# EAGLE design USB_carrier (EAGLE 5.11)
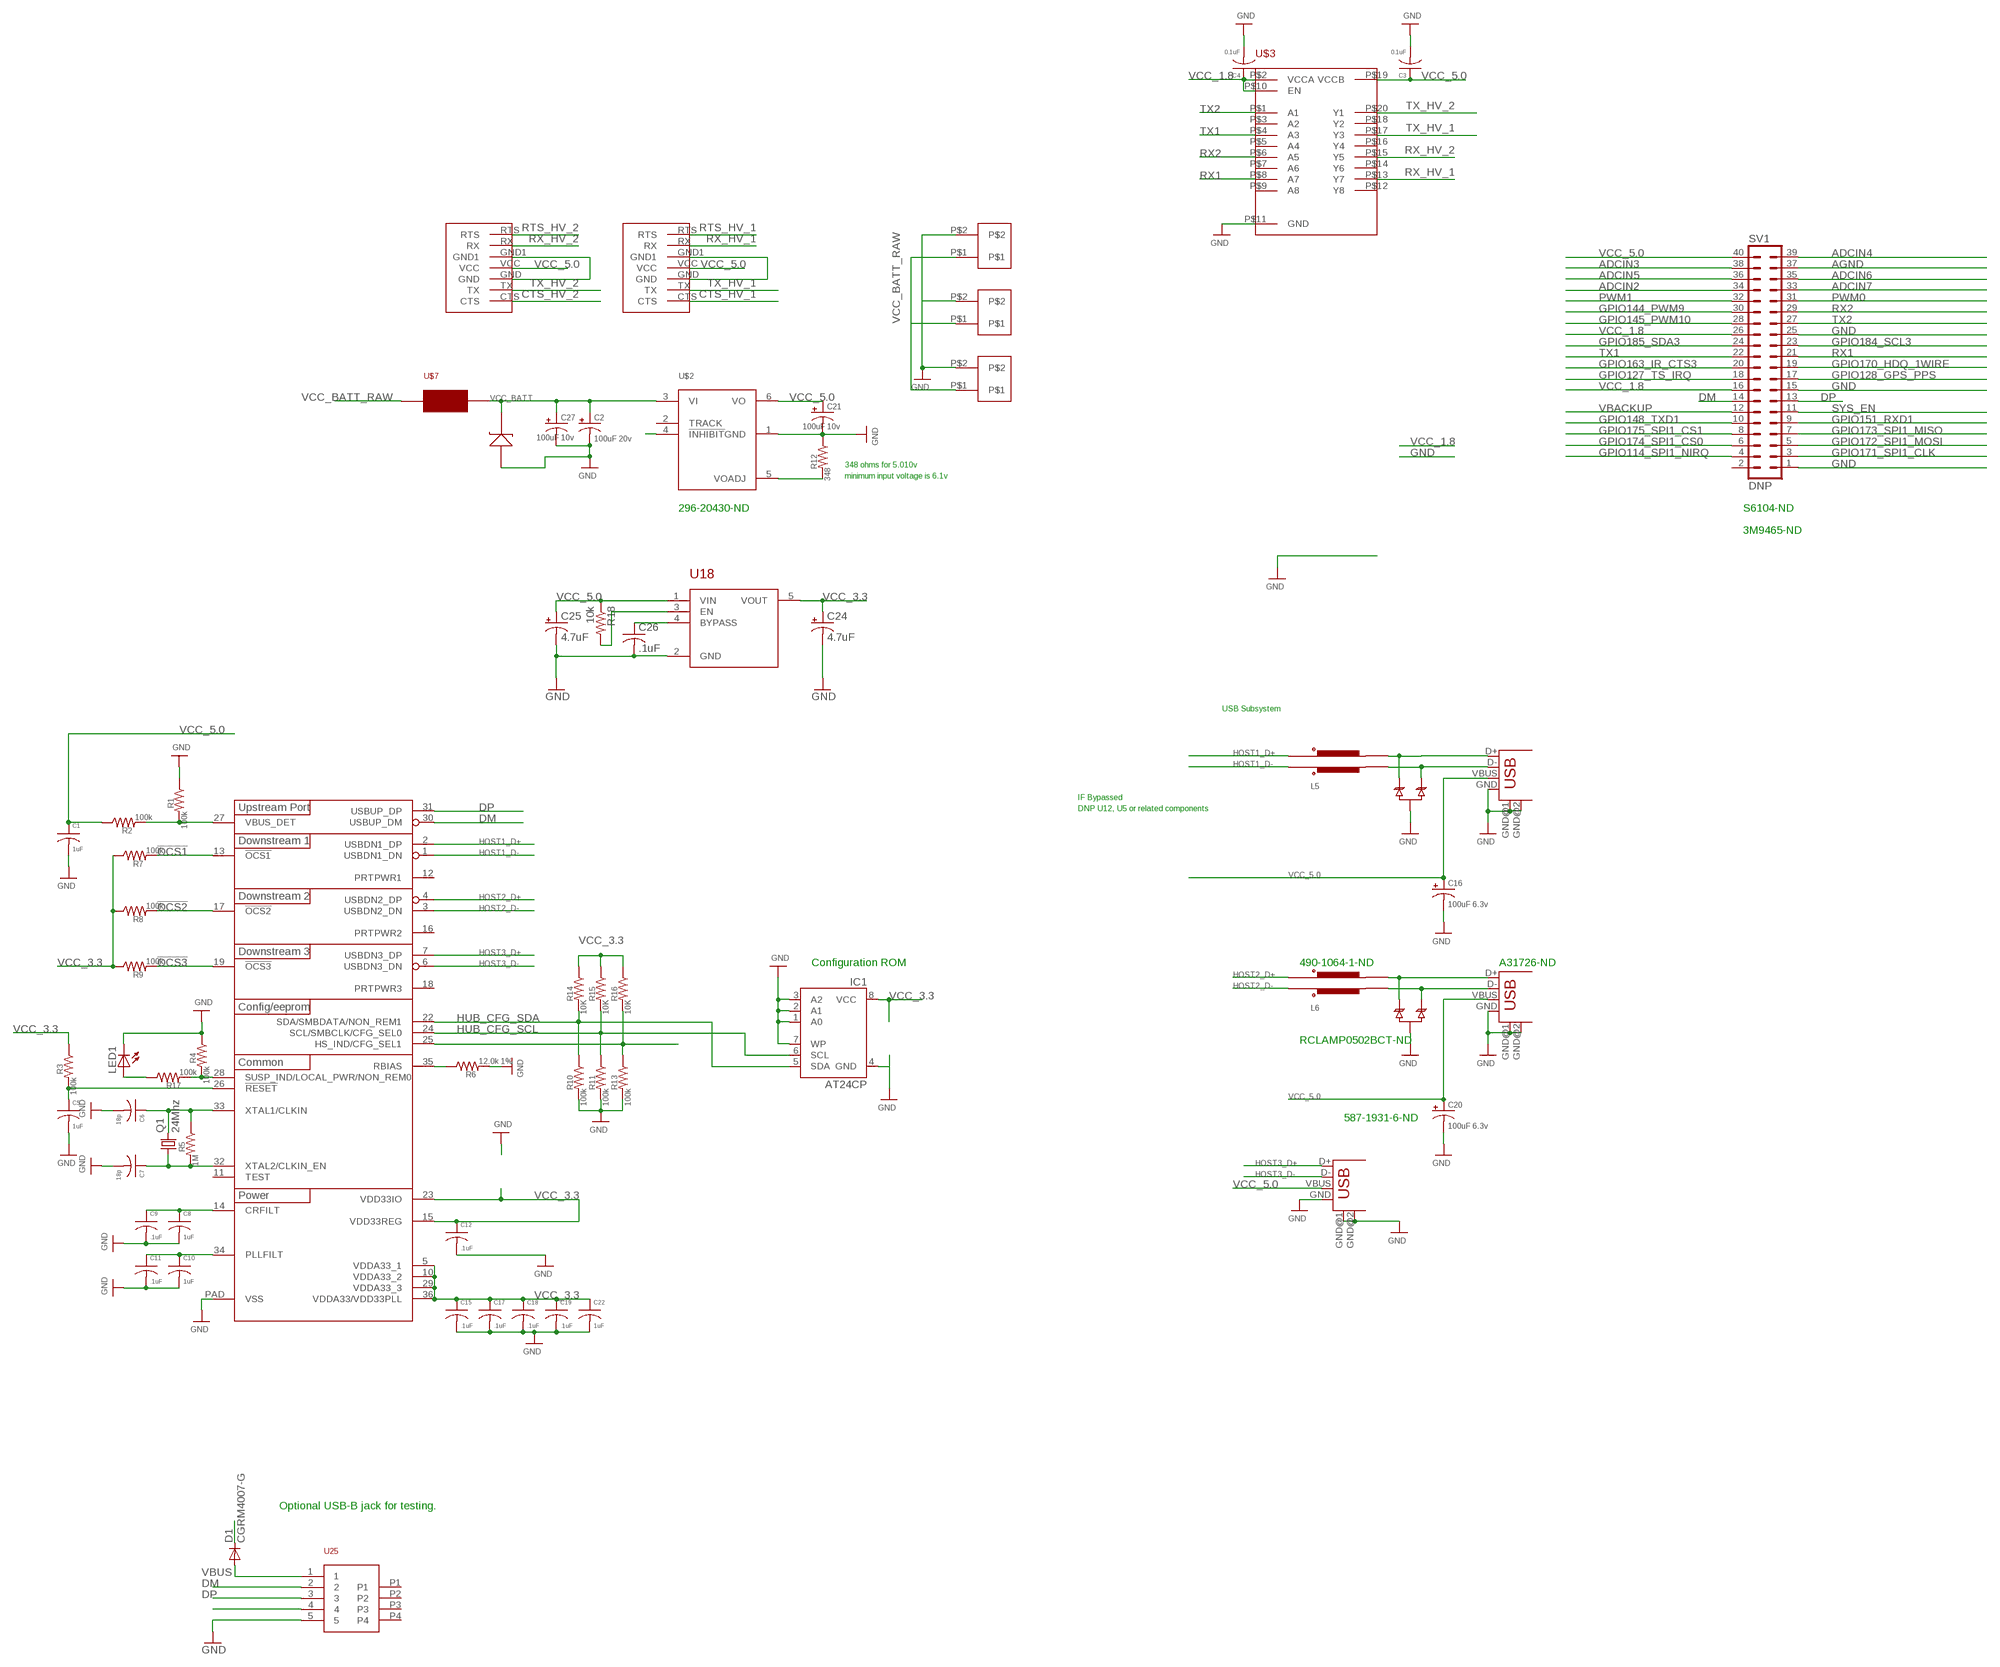
[diagram p0: schematic, sheet 1]

## Parts
C1  1uF  C0402-R  [C0402R]
C2  100uF 20v  CPOL-USE1.8-4  [E1,8-4]
C3  0.1uF  C0402-R  [C0402R]
C4  0.1uF  C0402-R  [C0402R]
C5  1uF  C0402-R  [C0402R]
C6  18p  C0402-R  [C0402R]
C7  18p  C0402-R  [C0402R]
C8  1uF  C0402-R  [C0402R]
C9  .1uF  C0402-R  [C0402R]
C10  1uF  C0402-R  [C0402R]
C11  .1uF  C0402-R  [C0402R]
C12  .1uF  C0402-R  [C0402R]
C15  .1uF  C0402-R  [C0402R]
C16  100uF 6.3v  CPOL-USE1.8-4  [E1,8-4]
C17  .1uF  C0402-R  [C0402R]
C18  .1uF  C0402-R  [C0402R]
C19  .1uF  C0402-R  [C0402R]
C20  100uF 6.3v  CPOL-USE1.8-4  [E1,8-4]
C21  100uF 10v  CPOL-USE1.8-4  [E1,8-4]
C22  1uF  C0402-R  [C0402R]
C24  4.7uF  CPOL-USR/2012-12R  [R/2012-12R]
C25  4.7uF  CPOL-USR/2012-12R  [R/2012-12R]
C26  .1uF  C-USC0402  [C0402]
C27  100uF 10v  CPOL-USE1.8-4  [E1,8-4]
D1  CGRM4007-G  [SOD-123_MINI-SMA]
IC1  AT24CP  [DIL08]
L5  FERITE_S0805  [SPLIT_0805]
L6  FERITE_S0805  [SPLIT_0805]
LED1  LEDCHIP-LED0805  [CHIP-LED0805]
Q1  24Mhz  CRYSTALHC49UP  [HC49UP]
R1  100k  R-US_R0402  [R0402]
R2  100k  R-US_R0402  [R0402]
R3  100k  R-US_R0402  [R0402]
R4  100k  R-US_R0402  [R0402]
R5  1M  R-US_R0603  [R0603]
R6  12.0k 1%  R-US_R0402  [R0402]
R7  100k  R-US_R0402  [R0402]
R8  100k  R-US_R0402  [R0402]
R9  100k  R-US_R0402  [R0402]
R10  100k  R-US_R0402  [R0402]
R11  100k  R-US_R0402  [R0402]
R12  348  R-US_R0603  [R0603]
R13  100k  R-US_R0402  [R0402]
R14  10K  R-US_R0402  [R0402]
R15  10K  R-US_R0402  [R0402]
R16  10K  R-US_R0402  [R0402]
R17  100k  R-US_R0402  [R0402]
R18  10k  R-US_R0402  [R0402]
SV1  DNP  MA20-2  [MA20-2]
U5  RCLAMP0502B  [SOT-523]
U6  RCLAMP0502B  [SOT-523]
U18  LDS3985XX33  [SOT23-5]
U25  1734035-1_USB  [1734035-1_1734035]
U$1  USB2513B  [QFN36]
U$2  PTH08000W  [PTH08000W]
U$3  ADG3300  [TSSOP-20]
U$4  SK152  [DO-214AB]
U$7  0154  [0154]
U$8  WASP7PIN  [WASP7PIN]
U$9  2P  [2PTH]
U$10  WASP7PIN  [WASP7PIN]
U$11  2P  [2PTH]
U$12  2P  [2PTH]
USB1  USB-A-H  [USB-A-H]
USB2  USB-A-H  [USB-A-H]
USB3  USB-A-H  [USB-A-H]

## Nets
!OCS1: R7.2 U$1.13(!OCS1)
!OCS2: R8.2 U$1.17(!OCS2)
!OCS3: R9.2 U$1.19(!OCS3)
!RESET: C5.1 R3.2 U$1.26(!RESET)
ADCIN2 [analog]: SV1.34
ADCIN3 [analog]: SV1.38
ADCIN4 [analog]: SV1.39
ADCIN5 [analog]: SV1.36
ADCIN6 [analog]: SV1.35
ADCIN7 [analog]: SV1.33
AGND [supply]: SV1.37
CFG_SEL1: R13.1 R16.2 U$1.25(HS_IND/CFG_SEL1)
CTS_HV_1: U$8.CTS
CTS_HV_2: U$10.CTS
DM: SV1.14 U25.2 U$1.30(USBUP_DM)
DP: SV1.13 U25.3 U$1.31(USBUP_DP)
GND [supply]: C1.2 C2.- C3.2 C4.2 C5.2 C6.2 C7.2 C8.2 C9.2 C10.2 C11.2 C12.2 C15.2 C16.- C17.2 C18.2 C19.2 C20.- C21.- C22.2 C24.- C25.- C26.2 C27.- IC1.1(A0) IC1.2(A1) IC1.3(A2) IC1.4(GND) IC1.7(WP) LED1.C R1.1 R4.1 R6.2 R10.2 R11.2 R12.1 R13.2 SV1.1 SV1.15 SV1.25 U5.3 U6.3 U18.2(GND) U25.5 U$1.PAD(VSS) U$2.1(GND) U$3.P$11(GND) U$4.AN U$8.GND U$8.GND1 U$9.P$2 U$10.GND U$10.GND1 U$11.P$2 U$12.P$2 USB1.GND USB1.GND@1(GND) USB1.GND@2(GND) USB2.GND USB2.GND@1(GND) USB2.GND@2(GND) USB3.GND USB3.GND@1(GND) USB3.GND@2(GND)
GPIO114_SPI1_NIRQ: SV1.4
GPIO127_TS_IRQ: SV1.18
GPIO128_GPS_PPS: SV1.17
GPIO144_PWM9: SV1.30
GPIO145_PWM10: SV1.28
GPIO148_TXD1: SV1.10
GPIO151_RXD1: SV1.9
GPIO163_IR_CTS3: SV1.20
GPIO170_HDQ_1WIRE: SV1.19
GPIO171_SPI1_CLK: SV1.3
GPIO172_SPI1_MOSI: SV1.5
GPIO173_SPI1_MISO: SV1.7
GPIO174_SPI1_CS0: SV1.6
GPIO175_SPI1_CS1: SV1.8
GPIO184_SCL3: SV1.23
GPIO185_SDA3: SV1.24
HOST1_D+: L5.1 U$1.2(USBDN1_DP)
HOST1_D+_UNFILTERED: L5.2 U5.2 USB1.D+
HOST1_D-: L5.4 U$1.1(USBDN1_DN)
HOST1_D-_UNFILTERED: L5.3 U5.1 USB1.D-
HOST2_D+: L6.1 U$1.4(USBDN2_DP)
HOST2_D-: L6.4 U$1.3(USBDN2_DN)
HOST3_D+: U$1.7(USBDN3_DP) USB3.D+
HOST3_D-: U$1.6(USBDN3_DN) USB3.D-
HUB_CFG_SCL: IC1.6(SCL) R11.1 R15.2 U$1.24(SCL/SMBCLK/CFG_SEL0)
HUB_CFG_SDA: IC1.5(SDA) R10.1 R14.2 U$1.22(SDA/SMBDATA/NON_REM1)
N$1: LED1.A R17.1
N$2: L6.3 U6.1 USB2.D-
N$3: R18.2 U18.3(EN)
N$4: R1.2 R2.2 U$1.27(VBUS_DET)
N$7: R4.2 R17.2 U$1.28(SUSP_IND/LOCAL_PWR/NON_REM0)
N$8: C7.1 Q1.1 R5.2 U$1.32(XTAL2/CLKIN_EN)
N$9: L6.2 U6.2 USB2.D+
N$11: C6.1 Q1.2 R5.1 U$1.33(XTAL1/CLKIN)
N$13: C8.1 C9.1 U$1.14(CRFILT)
N$14: C10.1 C11.1 U$1.34(PLLFILT)
N$15: R6.1 U$1.35(RBIAS)
N$18: C26.1 U18.4(BYPASS)
N$24: R12.2 U$2.5(VOADJ)
N$25: U$2.4(!INHIBIT)
PWM0: SV1.31
PWM1: SV1.32
RTS_HV_1: U$8.RTS
RTS_HV_2: U$10.RTS
RX1: SV1.21 U$3.P$8(A7)
RX2: SV1.29 U$3.P$6(A5)
RX_HV_1: U$3.P$13(Y7) U$8.RX
RX_HV_2: U$3.P$15(Y5) U$10.RX
SYS_EN: SV1.11
TX1: SV1.22 U$3.P$4(A3)
TX2: SV1.27 U$3.P$1(A1)
TX_HV_1: U$3.P$17(Y3) U$8.TX
TX_HV_2: U$3.P$20(Y1) U$10.TX
USBID: U25.4
VBACKUP: SV1.12
VBUS: D1.A U25.1
VCC_1.8 [supply]: C4.1 SV1.16 SV1.26 U$3.P$2(VCCA) U$3.P$10(EN)
VCC_3.3 [supply]: C12.1 C15.1 C17.1 C18.1 C19.1 C22.1 C24.+ IC1.8(VCC) R3.1 R7.1 R8.1 R9.1 R14.1 R15.1 R16.1 U18.5(VOUT) U$1.5(VDDA33_1) U$1.10(VDDA33_2) U$1.15(VDD33REG) U$1.23(VDD33IO) U$1.29(VDDA33_3) U$1.36(VDDA33/VDD33PLL)
VCC_5.0: C1.1 C3.1 C16.+ C20.+ C21.+ C25.+ D1.C R2.1 R18.1 SV1.40 U18.1(VIN) U$2.6(VO) U$3.P$19(VCCB) U$8.VCC U$10.VCC USB1.VBUS USB2.VBUS USB3.VBUS
VCC_BATT: C2.+ C27.+ U$2.3(VI) U$4.CAT U$7.2
VCC_BATT_RAW: U$7.1 U$9.P$1 U$11.P$1 U$12.P$1
Unconnected: SV1.2 U25.P1 U25.P2 U25.P3 U25.P4 U$1.11(TEST) U$1.12(PRTPWR1) U$1.16(PRTPWR2) U$1.18(PRTPWR3) U$2.2(TRACK) U$3.P$3(A2) U$3.P$5(A4) U$3.P$7(A6) U$3.P$9(A8) U$3.P$12(Y8) U$3.P$14(Y6) U$3.P$16(Y4) U$3.P$18(Y2)

## Notes on the sheet
- 348 ohms for 5.010v
- minimum input voltage is 6.1v
- 296-20430-ND | S6104-ND
- 3M9465-ND
- USB Subsystem
- IF Bypassed
- DNP U12, U5 or related components
- Configuration ROM | 490-1064-1-ND | A31726-ND
- RCLAMP0502BCT-ND
- 587-1931-6-ND
- Optional USB-B jack for testing.

## Library data of the parts
C1 C3-C12 C15 C17-C19 C22 = qualified_1:C
C2 C21 C27 = resistor:CPOL-US: POLARIZED CAPACITOR, American symbol
C16 C20 C24 C25 = rcl:CPOL-US: POLARIZED CAPACITOR, American symbol
C26 = rcl:C-US: CAPACITOR, American symbol
D1 = diode:CGRM400*-G: Molded plasitc,JEDEC SOD-123/Mini SMA Source: Comchip CGRM4001-G.pdf
IC1 = atmel:AT24C*: 2-wire serial EEPROM; MPN: AT24C1024BW-SH-B; OC_FARNELL: 1362646; OC_NEWARK: 03P2044
L5 L6 = ferrite_split_0805:FERITE_S0805
LED1 = led:LED: LED OSRAM: - CHIPLED LG R971, LG N971, LY N971, LG Q971, LY Q971, LO R971, LY R971 LH N974, LH R974 LS Q976, LO Q976, LY Q976 LO Q996 - Hyper CHIPLED LW Q18S LB Q993, LB Q99A, LB R99A - SideLED LS A670, LO A670, LY A670, LG A670, LP A670 LB A673, LV A673, LT A673, LW A673 LH A674 LY A675 LS A676, LA A676, LO A676, LY A676, LW A676 LS A679, LY A679, LG A679 - Hyper Micro SIDELED® LS Y876, LA Y876, LO Y876, LY Y876 LT Y87S - SmartLED LW L88C, LW L88S LB L89C, LB L89S, LG L890 LS L89K, LO L89K, LY L89K LS L896, LA L896, LO L896, LY L896 - TOPLED LS T670, LO T670, LY T670, LG T670, LP T670 LSG T670, LSP T670, LSY T670, LOP T670, LYG T670 LG T671, LOG T671, LSG T671 LB T673, LV T673, LT T673, LW T673 LH T674 LS T676, LA T676, LO T676, LY T676, LB T676, LH T676, LSB T676, LW T676 LB T67C, LV T67C, LT T67C, LS T67K, LO T67K, LY T67K, LW E67C LS E67B, LA E67B, LO E67B, LY E67B, LB E67C, LV E67C, LT E67C LW T67C LS T679, LY T679, LG T679 LS T770, LO T770, LY T770, LG T770, LP T770 LB T773, LV T773, LT T773, LW T773 LH T774 LS E675, LA E675, LY E675, LS T675 LS T776, LA T776, LO T776, LY T776, LB T776 LHGB T686 LT T68C, LB T68C - Hyper Mini TOPLED® LB M676 - Mini TOPLED Santana® LG M470 LS M47K, LO M47K, LY M47K Source: http://www.osram.convergy.de LUXEON: - LUMILED® LXK2-PW12-R00, LXK2-PW12-S00, LXK2-PW14-U00, LXK2-PW14-V00 LXK2-PM12-R00, LXK2-PM12-S00, LXK2-PM14-U00 LXK2-PE12-Q00, LXK2-PE12-R00, LXK2-PE12-S00, LXK2-PE14-T00, LXK2-PE14-U00 LXK2-PB12-K00, LXK2-PB12-L00, LXK2-PB12-M00, LXK2-PB14-N00, LXK2-PB14-P00, LXK2-PB14-Q00 LXK2-PR12-L00, LXK2-PR12-M00, LXK2-PR14-Q00, LXK2-PR14-R00 LXK2-PD12-Q00, LXK2-PD12-R00, LXK2-PD12-S00 LXK2-PH12-R00, LXK2-PH12-S00 LXK2-PL12-P00, LXK2-PL12-Q00, LXK2-PL12-R00 Source: www.luxeon.com KINGBRIGHT: KA-3528ASYC Source: www.kingbright.com
Q1 = crystal:CRYSTAL: CRYSTAL; OC_FARNELL: unknown; OC_NEWARK: unknown
R1-R18 = rcl:R-US_: RESISTOR, American symbol
SV1 = con-lstb:MA20-2: PIN HEADER
U5 U6 = rclamp0502b:RCLAMP0502B
U18 = LDS3985XX33:LDS3985XX33
U25 = YESIN_USB:1734035-1_USB
U$1 = usb251x:USB2513B
U$2 = PTH0800W:PTH08000W
U$3 = ADG3300:ADG3300
U$4 = SK152:SK152
U$7 = SMT_Fuse_0154001:0154
U$8 U$10 = wasp7pin:WASP7PIN
U$9 U$11 U$12 = con_2h_70555-0001:2P
USB1-USB3 = con-usb-2:USB: USB Connectors

## Net classes
5 USB: width 0.191 mm

## Board
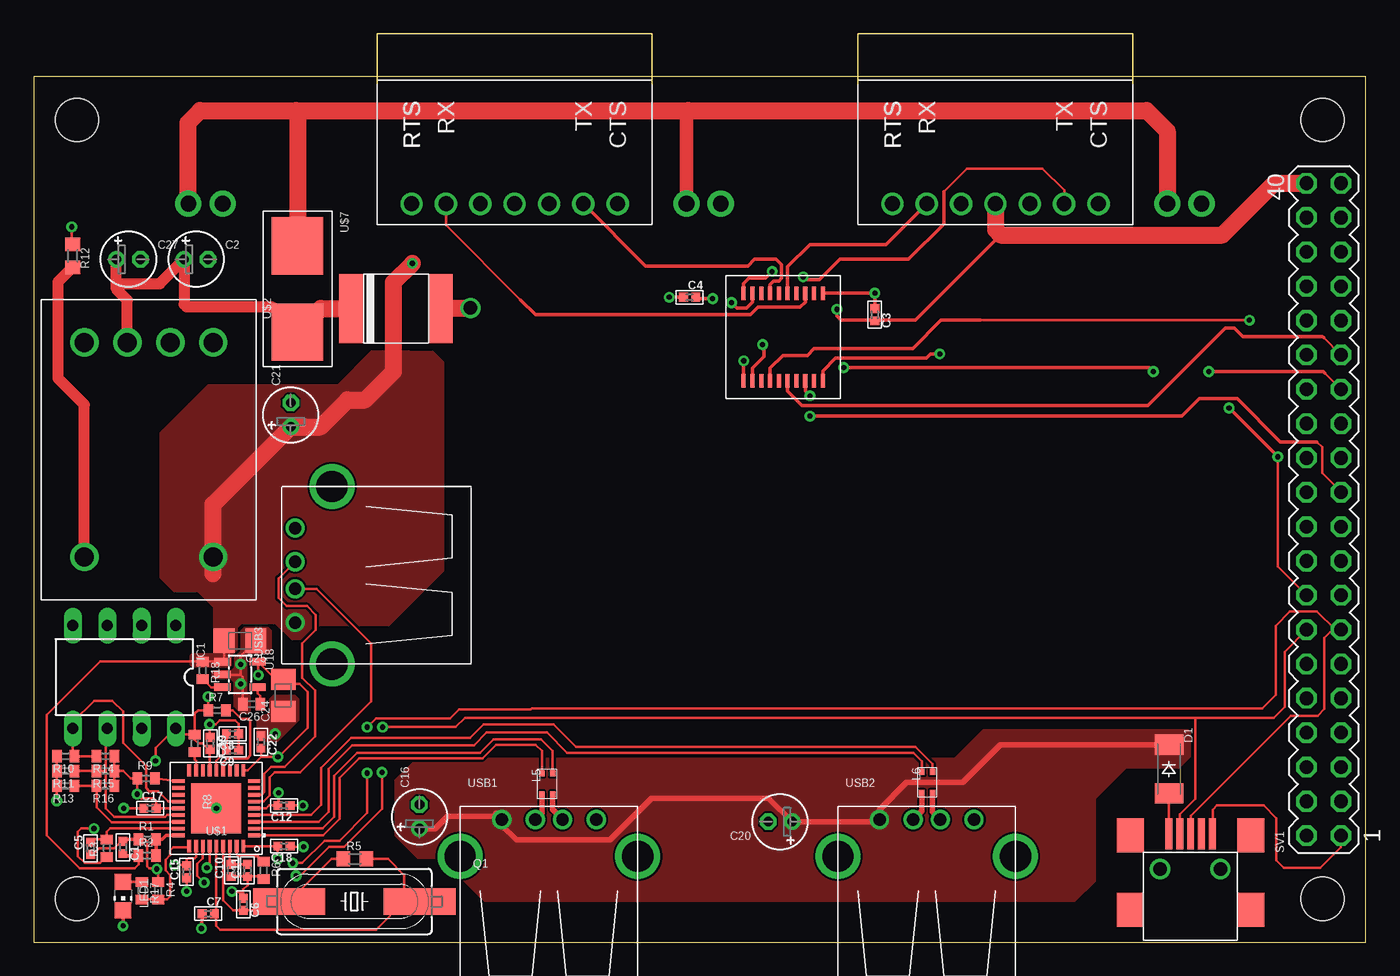
[diagram p1: board, top side]
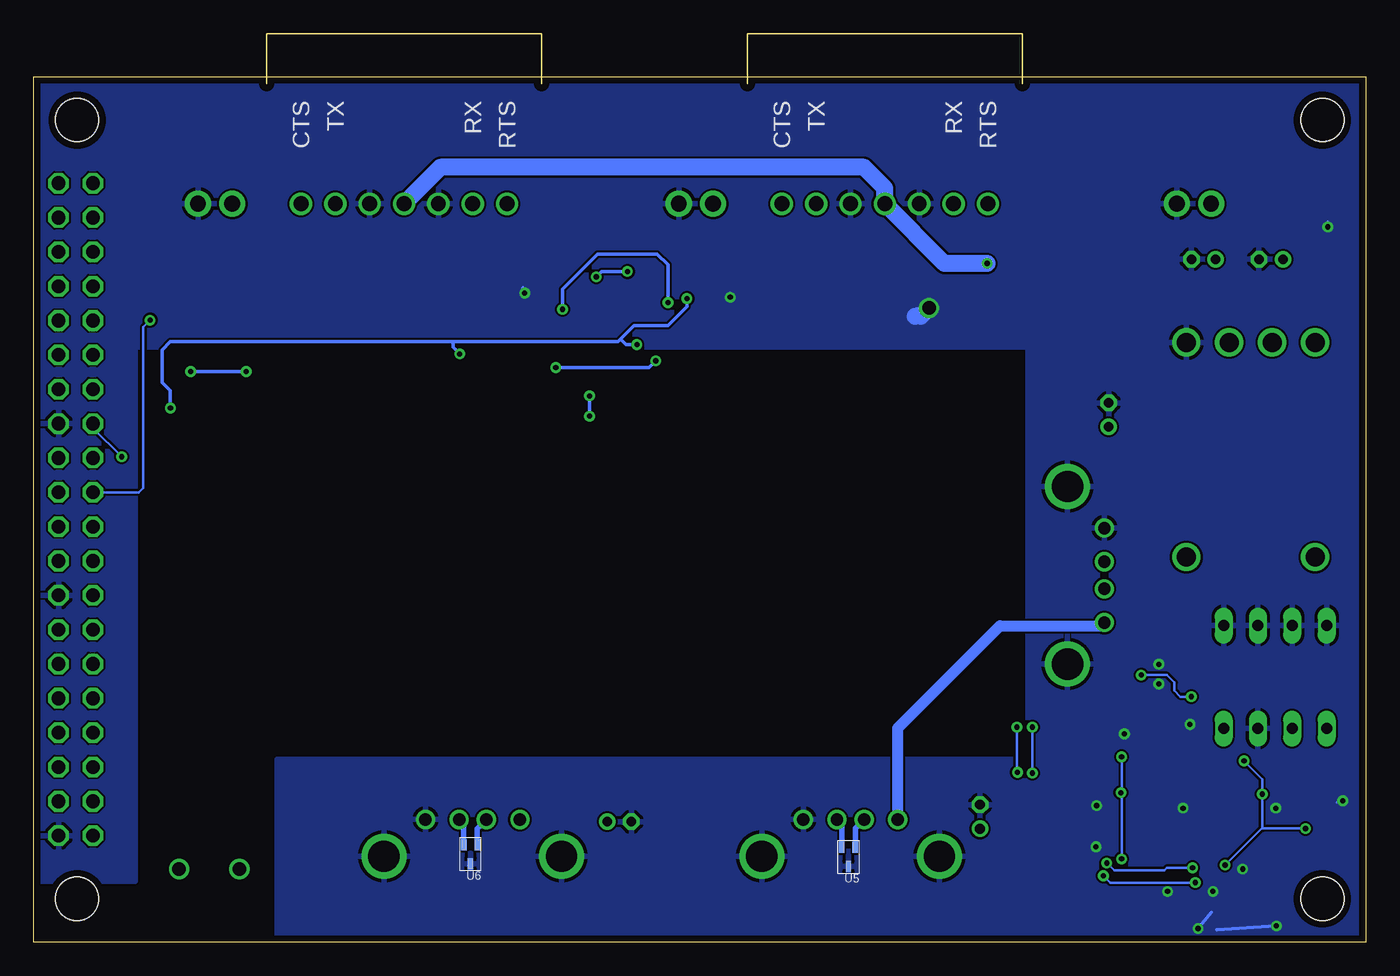
[diagram p2: board, bottom side, seen from below]

Size 98.5 x 64 mm. Coordinates in mm from the lower left corner, seen from the top.
Outline: 0,0 98.5,0 98.5,64 0,64 0,0
Copper layers (1*16): Top 0.035mm / dielectric 1.5mm / Bottom 0.035mm
Design rules "default *": minimum track width 6mil, minimum drill 15mil, track to track 6mil, track to pad 6mil, pad to pad 6mil, via to via 6mil, smd to smd 6mil, copper to edge 20mil, drill to drill 6mil, minimum pad ring 10mil, minimum via ring 8mil, stop-mask expansion 4mil, vias tented up to drill 20mil, thermal gap 10mil
Holes 3.2 mm at 3.2,60.8 95.3,60.8 95.3,3.2 3.2,3.2

### Footprints (pad centres in the part's own frame; a part is rotated, then mirrored left to right if it is on the bottom)
C0402R = smd 0.65 x 0.65: 1 -0.45,0; 2 0.45,0
E1,8-4 = drill 0.711 pad 1.168 round: + -0.889,0 | drill 0.711 pad 1.168 octagon: - 0.889,0
R/2012-12R = smd 1.55 x 1.8: + 1.175,0; - -1.175,0
C0402 = smd 0.7 x 0.9: 1 -0.65,0; 2 0.65,0
SOD-123_MINI-SMA = smd 1.5 x 2.1: A 1.8,0; C -1.8,0
DIL08 = drill 0.813 long: 1 -3.81,-3.81; 2 -1.27,-3.81; 3 1.27,-3.81; 4 3.81,-3.81; 5 3.81,3.81; 6 1.27,3.81; 7 -1.27,3.81; 8 -3.81,3.81
SPLIT_0805 = smd 0.45 x 0.4: 1 0.225,-0.2; 2 1.775,-0.2; 3 1.775,-1; 4 0.225,-1
CHIP-LED0805 = smd 1.2 x 1.2: A 0,-1.05; C 0,1.05
HC49UP = smd 5.334 x 1.93: 1 -4.826,0; 2 4.826,0
R0402 = smd 0.7 x 0.9: 1 -0.65,0; 2 0.65,0
R0603 = smd 1 x 1.1: 1 -0.85,0; 2 0.85,0
MA20-2 = drill 1.016 octagon: 1 -24.13,-1.27; 2 -24.13,1.27; 3 -21.59,-1.27; 4 -21.59,1.27; 5 -19.05,-1.27; 6 -19.05,1.27; 7 -16.51,-1.27; 8 -16.51,1.27; 9 -13.97,-1.27; 10 -13.97,1.27; 11 -11.43,-1.27; 12 -11.43,1.27; 13 -8.89,-1.27; 14 -8.89,1.27; 15 -6.35,-1.27; 16 -6.35,1.27; 17 -3.81,-1.27; 18 -3.81,1.27; 19 -1.27,-1.27; 20 -1.27,1.27; 21 1.27,-1.27; 22 1.27,1.27; 23 3.81,-1.27; 24 3.81,1.27; 25 6.35,-1.27; 26 6.35,1.27; 27 8.89,-1.27; 28 8.89,1.27; 29 11.43,-1.27; 30 11.43,1.27; 31 13.97,-1.27; 32 13.97,1.27; 33 16.51,-1.27; 34 16.51,1.27; 35 19.05,-1.27; 36 19.05,1.27; 37 21.59,-1.27; 38 21.59,1.27; 39 24.13,-1.27; 40 24.13,1.27
SOT-523 = smd 0.4 x 0.8: 1 0,0; 2 1,0; 3 0.5,1.4
SOT23-5 = smd 0.55 x 1.2: 1 -0.95,-1.3; 2 0,-1.3; 3 0.95,-1.3; 4 0.95,1.3; 5 -0.95,1.3
1734035-1_1734035 = smd 2.3 x 0.5: 1 -1.15,1.6; 2 -1.15,0.8; 3 -1.15,0; 4 -1.15,-0.8; 5 -1.15,-1.6 | smd 2.5 x 2: P1 -6.75,4.45; P2 -1.25,4.45; P3 -1.25,-4.45; P4 -6.75,-4.45 | drill 1 pad 1.3 round: P$1 -3.75,-2.2; P$2 -3.75,2.25
QFN36 = smd 0.9 x 0.28: 1 -2.8,2; 2 -2.8,1.5; 3 -2.8,1; 4 -2.8,0.5; 5 -2.8,0; 6 -2.8,-0.5; 7 -2.8,-1; 8 -2.8,-1.5; 9 -2.8,-2; 19 2.8,-2; 20 2.8,-1.5; 21 2.8,-1; 22 2.8,-0.5; 23 2.8,0; 24 2.8,0.5; 25 2.8,1; 26 2.8,1.5; 27 2.8,2 | smd 0.28 x 0.9: 10 -2,-2.8; 11 -1.5,-2.8; 12 -1,-2.8; 13 -0.5,-2.8; 14 0,-2.8; 15 0.5,-2.8; 16 1,-2.8; 17 1.5,-2.8; 18 2,-2.8; 28 2,2.8; 29 1.5,2.8; 30 1,2.8; 31 0.5,2.8; 32 0,2.8; 33 -0.5,2.8; 34 -1,2.8; 35 -1.5,2.8; 36 -2,2.8 | smd 3.7 x 3.7: PAD 0,0
PTH08000W = drill 1.4 round: 1 0,9.525; 2 0,6.35; 3 0,3.175; 4 0,0; 5 15.875,0; 6 15.875,9.525
TSSOP-20 = smd 0.3 x 1: P$1 0,0; P$2 0.65,0; P$3 1.3,0; P$4 1.95,0; P$5 2.6,0; P$6 3.25,0; P$7 3.9,0; P$8 4.55,0; P$9 5.2,0; P$10 5.85,0; P$11 5.85,6.5; P$12 5.2,6.5; P$13 4.55,6.5; P$14 3.9,6.5; P$15 3.25,6.5; P$16 2.6,6.5; P$17 1.95,6.5; P$18 1.3,6.5; P$19 0.65,6.5; P$20 0,6.5
DO-214AB = smd 1.778 x 5.08: AN -0.889,2.54; CAT 5.715,2.54
0154 = smd 4.24 x 3.81: 1 0,0; 2 6.38,0
WASP7PIN = drill 1.1 round: CTS 0,0; GND 5.08,0; GND1 10.16,0; RTS 15.24,0; RX 12.7,0; TX 2.54,0; VCC 7.62,0
2PTH = drill 1.168 pad 1.93 round: P$1 -2.54,0; P$2 0,0
USB-A-H = drill 0.914 round: D+ 2.718,-1.003; D- 2.718,1.003; GND 2.718,-3.493; VBUS 2.718,3.493 | drill 2.311 round: GND@1 0,6.566; GND@2 0,-6.566

### Placement (x,y rotation side)
C1  6.6,7 90 top
C2  12,50.5 0 top
C3  62.2,46.4 90 top
C4  48.5,47.7 180 top
C5  4.2,6.95 270 top
C6  15.5,2.8 90 top
C7  12.9,2.1 180 top
C8  14.7,15.4 0 top
C9  14.7,14.2 0 top
C10  14.6,5.3 270 top
C11  15.8,5.3 270 top
C12  18.5,10.1 0 top
C15  11.3,5.2 270 top
C16  28.53,9.27 90 top
C17  8.6,9.9 180 top
C18  18.5,7.1 0 top
C19  13.05,14.7 90 top
C20  55.2,8.91 180 top
C21  19,39 90 top
C22  16.8,14.8 90 top
C24  18.45,18.25 90 top
C25  15.25,22.3 180 top
C26  16.1,17.6 180 top
C27  7,50.5 0 top
D1  83.95,12.8 270 top
IC1  6.7,19.6 180 top
L5  38.57,12.7 270 top
L6  66.67,12.81 270 top
LED1  6.6,3.4 180 top
Q1  23.7,3 180 top
R1  8.4,7.6 0 top
R2  8.4,6.4 0 top
R3  5.4,6.95 90 top
R4  9.2,3.8 270 top
R5  23.75,6.15 0 top
R6  17,5.3 270 top
R7  13.55,17.15 0 top
R8  11.9,14.7 270 top
R9  8.3,12.1 0 top
R10  2.35,13.75 180 top
R11  2.35,12.65 180 top
R12  2.87,50.76 270 top
R13  2.35,11.55 180 top
R14  5.3,13.75 180 top
R15  5.3,12.65 180 top
R16  5.3,11.55 180 top
R17  8,3.8 270 top
R18  12.5,20.1 270 top
SV1  95.4,32 90 top
U5  37.75,7 180 bottom
U6  65.71,7.2 180 bottom
U18  15.25,19.8 270 top
U25  85.55,9.15 90 top
U$1  13.5,9.9 180 top
U$2  3.74,44.36 270 top
U$3  52.5,41.5 0 top
U$4  29.2,49.4 180 top
U$7  19.5,51.5 270 top
U$8  43.18,54.61 180 top
U$9  86.36,54.61 0 top
U$10  78.74,54.61 180 top
U$11  13.97,54.61 0 top
U$12  50.8,54.61 0 top
USB1  38.1,6.35 90 top
USB2  66.04,6.35 90 top
USB3  22.05,27.13 180 top

### Tracks (layer width: path | path; a pad name or v marks a point on that pad's centre or on a via)
!OCS1
  Top 0.203: U$1.13 14,13.3 14.3,13.6 15.8,13.6 16,13.8 16,16.4 15.9,16.5 15.35,16.5 14.7,17.15 R7.2
!OCS2
  Top 0.203: U$1.17 12,13.4 11.9,13.5 R8.2
!OCS3
  Top 0.203: R9.2 U$1.19
!RESET
  Top 0.203: U$1.26 5.65,8.4 5.4,8.15 R3.2 4.4,7.6 C5.1
CFG_SEL1
  Top 0.203: R13.1 R16.2 4.65,9.95 5.75,8.85 9.95,8.85 10,8.9 U$1.25
DM  (via drill 0.38)
  Top 0.203: SV1.14 92.5,21.48 92.5,17.4 91.7,16.6 85.9,16.6 | U$1.30 12.5,6.2 12.1,5.8 12.1,4.9 v12.6,4.4 | v25.75,12.55 25.75,9.85 22.95,7.05 21.85,7.05 19.7,4.9 v19.4,4.9 | v25.8,15.9 31.2,15.9 31.9,16.6 85.9,16.6 | U25.2 84.75,9.45 85.9,10.6 85.9,16.6
  Bottom 0.203: v12.6,4.4 18.9,4.4 v19.4,4.9 | v25.75,12.55 25.8,12.6 v25.8,15.9
DP  (via drill 0.38)
  Top 0.203: U$1.31 13,5.7 v12.8,5.5 | v19.15,5.85 19.85,5.85 21.5,7.5 22.6,7.5 24.65,9.55 v24.65,12.5 | v24.65,15.9 25.3,16.55 30.8,16.55 31.45,17.2 36.75,17.2 36.85,17.3 90.85,17.3 91.85,18.3 91.85,23.4 92.9,24.45 94.9,24.45 96.24,23.11 SV1.13 96.06,23.11 95.45,22.5 95.45,17.25 94.95,16.75 92.95,16.75 85.55,9.35 U25.3
  Bottom 0.203: v12.8,5.5 14.7,5.5 14.9,5.3 18.6,5.3 v19.15,5.85 | v24.65,12.5 v24.65,15.9
GND  (via drill 0.38, 1)
  Top 0.203: R12.1 2.8,51.68 v2.8,52.9 | R4.1 9.2,5.3 v9.1,5.4 9.05,5.45 8.55,5.45 8.4,5.6 8.4,7.45 8.25,7.6 R1.1 | C12.2 v19.9,10.1 | C9.2 C8.2 15.15,16.15 14.9,16.4 13.75,16.4 13.45,16.1 v13,16.1 13,15.2 C19.2 | C10.2 C11.2 | C11.2 16.8,4.85 R6.2 | 15.5,3.75 15.5,3.9 15.8,4.2 C11.2 | 15.5,3.75 C6.2 | v14.65,3.75 15.4,3.65 15.5,3.75 | C25.- 15.3,21.18 v15.3,20.55 15.3,19.75 | 15.3,19.75 15.45,19.6 C26.2 | U18.2 14,19.75 15.3,19.75 | C15.2 v11.3,3.75 | v6.65,9.9 C17.2 | C18.2 19,7.05 v19.95,7.05 | R10.2 R11.2 R13.2 v1.7,10.45 | C5.2 4.3,6.4 4.85,6.95 5.95,6.95 6.45,7.45 C1.2 | U25.5 87.2,8.05 87.2,9.8 87.5,10.1 90.95,10.1 91.9,9.15 91.9,6.05 92.45,5.5 95.15,5.5 96.67,7.02 SV1.1
  Top 0.254: C4.2 v47,47.7 | C3.2 v62.2,48 U$3.P$11 | C7.2 v12.4,1 | C1.2 6.75,7.6 R1.1 | LED1.C v6.6,1.2
  Top 1.27: U$4.AN 30.13,46.9 v32.3,46.9
  Bottom 0.203: v2.8,52.9 2.8,53.3 | v9.1,5.4 8.9,5.4 | v13,16.1 13,16.4 | v11.3,3.75 11.3,3.55 | v6.65,9.9 6.65,10.15 | v19.95,7.05 19.95,7.3 | v1.7,10.45 1.8,10.35 2.15,10.35
  Bottom 0.254: 47,48 v47,47.7 47,47.5 47.1,47.5 | v62.2,48 62.3,48.1 62.3,48.4 | v12.4,1 11.4,2.2 | v6.6,1.2 11,0.9
  Bottom 1.27: v32.3,46.9 32.9,46.3 33.3,46.3
  other vias: 15.3,19.1 17.85,15.4 13.5,9.9
  pour Bottom: -1,65 100,65 100,41.5 100,4.5 91,4.5 91,44 78.5,44 25,44 25,13.5 80.5,13.5 80.5,-1.5 -1,-1.5
  pour Top (no thermals): 13.3,20.1 14.65,20.1 14.85,20.3 14.85,21.05 15.35,21.55 15.35,23.05 15.6,23.3 17.3,23.3 17.55,23.05 17.55,21.55 17.3,21.3 16.05,21.3 15.75,21 15.75,18.45 16,18.2 16,17.05 15.85,16.9 15,16.9 14.8,17.1 14.8,19.2 14.55,19.45 13.3,19.45 13.2,19.55 13.2,20
  pour Top (no thermals): 16.5,15.15 16.5,16.4 16.95,16.85 17.25,16.85 17.45,17.05 17.45,18 17.75,18.3 19.3,18.3 19.6,18 19.6,16.4 18,14.8 16.6,14.8 16.5,14.9
HOST1_D+
  Top 0.203: L5.1 38.37,14.13 37.5,15 34,15 33,14 23.9,14 22.2,12.3 22.2,9.25 21.35,8.4 U$1.2
HOST1_D+_UNFILTERED
  Top 0.406: L5.2 38.37,9.8 USB1.D+
  Bottom 0.406: U5.2 38.75,8.71 USB1.D+
HOST1_D-
  Top 0.203: L5.4 37.57,14.13 37.1,14.6 34.2,14.6 33.2,13.6 24.05,13.6 22.6,12.15 22.6,9.1 21.4,7.9 U$1.1
HOST1_D-_UNFILTERED
  Top 0.406: L5.3 37.57,9.54 USB1.D-
  Bottom 0.406: U5.1 37.75,8.41 USB1.D-
HOST2_D+
  Top 0.203: U$1.4 20.5,9.4 21.25,10.15 21.25,12.9 23.45,15.1 32.25,15.1 33.25,16.1 38.45,16.1 40.1,14.45 65.2,14.45 66.47,13.18 L6.1
HOST2_D-
  Top 0.203: U$1.3 21.05,8.9 21.8,9.65 21.8,12.8 23.55,14.55 32.55,14.55 33.5,15.5 37.95,15.5 39.45,14 65.05,14 65.67,13.38 L6.4
HOST3_D+
  Top 0.203: U$1.7 16.85,10.9 17.05,11.1 17.05,12.45 17.55,12.95 18.55,12.95 20.8,15.2 20.8,18.6 19.85,19.55 19.85,22.1 20.85,23.1 20.85,24.2 20.2,24.85 18.7,24.85 18.1,25.45 18.1,26.9 USB3.D+
HOST3_D-
  Top 0.203: U$1.6 17,10.4 17.45,10.85 17.45,12.2 17.8,12.55 19.7,12.55 24.95,17.8 24.95,22.1 20.92,26.13 USB3.D-
HUB_CFG_SCL
  Top 0.203: U$1.24 9.85,9.4 9.7,9.25 5.95,9.25 5.3,9.9 5.3,12.65 | R11.1 R15.2 5.3,12.65 | IC1.6 5.3,15.66 5.3,12.65
HUB_CFG_SDA
  Top 0.203: U$1.22 9.95,10.4 9.2,11.15 8.55,11.15 8.3,11.4 8.3,13.05 6.6,14.75 6.6,17.05 5.8,17.85 4.45,17.85 2.89,16.29 IC1.5 2.89,13.86 R10.1 R14.2
N$1
  Top 0.203: LED1.A R17.1
N$2
  Top 0.406: L6.3 65.67,9.7 USB2.D-
  Bottom 0.406: U6.1 65.71,8.39 USB2.D-
N$3
  Top 0.203: U18.3 13.1,18.85 R18.2
N$4
  Top 0.254: U$1.27 9.8,7.9 9.5,7.6 R1.2 R2.2
N$7
  Top 0.203: R17.2 R4.2 9.85,3.15 10.1,3.4 10.1,4.95 9.75,5.3 9.75,6.1 10.1,6.45 10.1,6.8 10.3,7 11.4,7 U$1.28
N$8
  Top 0.203: 27.4,3 25.3,0.9 13.8,0.9 13.5,1.2 13.5,2.25 U$1.32 | 27.4,3 Q1.1 | 27.4,3 27.4,4.95 26.2,6.15 R5.2
  Top 0.254: 13.5,2.25 C7.1 13.47,1.98
N$9
  Top 0.406: L6.2 66.47,9.64 USB2.D+
  Bottom 0.406: U6.2 66.71,8.73 USB2.D+
N$11
  Top 0.203: U$1.33 14,3.1 14.75,2.35 C6.1 18.22,2.35 arc90 Q1.2 22.02,6.15 R5.1
N$13
  Top 0.203: C8.1 C9.1 14.25,14.15 13.5,13.4 U$1.14
N$14
  Top 0.203: C11.1 C10.1 14.5,5.85 U$1.34
N$15
  Top 0.203: U$1.35 15,6.5 15.15,6.35 16.6,6.35 R6.1
N$18
  Top 0.203: C26.1 16.75,18.2 16.55,18.4 U18.4
N$24
  Top 0.813: U$2.5 3.74,39.76 1.8,41.7 1.8,48.84 R12.2
RX1  (via drill 0.38)
  Top 0.203: SV1.21 96.67,33.33 95.3,34.7 95.3,36.6 94.9,37
  Top 0.254: 94.9,37 92.2,37 89,40.2 86.2,40.2 84.9,38.9 v57.4,38.9 | U$3.P$8 57.05,40.75 v57.4,40.4
  Bottom 0.254: v57.4,38.9 v57.4,40.4
RX2
  Top 0.203: 95.4,44.7 SV1.29
  Top 0.254: 95.4,44.7 95.3,44.8 89.4,44.8 88.8,45.4 88.1,45.4 82.4,39.7 56.8,39.7 55.75,40.75 U$3.P$6
RX_HV_1
  Top 0.203: U$8.RX 30.48,53.02 36,47.5
  Top 0.254: 36,47.5 37.1,46.4 53,46.4 53.55,46.95 56.65,46.95 57.05,47.35 U$3.P$13
RX_HV_2
  Top 0.254: U$10.RX 63.03,51.6 57.4,51.6 55.75,49.95 U$3.P$15
TX1  (via drill 0.38)
  Top 0.203: 70,46 v89.9,46
  Top 0.254: 70,46 67.1,46 65,43.9 57.7,43.9 57.2,43.4 55.4,43.4 54.45,42.45 U$3.P$4
  Bottom 0.203: SV1.22 90.73,33.27 90.4,33.6 90.4,45.5 v89.9,46
TX2  (via drill 0.38)
  Top 0.203: 95.46,42.1 SV1.27
  Top 0.254: 95.46,42.1 95.36,42.2 v86.9,42.2 | v82.8,42.2 82.5,42.5 v59.9,42.5 | U$3.P$1 v52.5,43
  Bottom 0.254: v82.8,42.2 v86.9,42.2 | v59.9,42.5 53,42.5 v52.5,43
TX_HV_1
  Top 0.254: U$8.TX 45.25,50 52.8,50 53.3,50.5 54.9,50.5 55.3,50.1 55.3,49.1 55.1,48.9 54.7,48.9 54.45,48.65 U$3.P$17
TX_HV_2  (via drill 0.38)
  Top 0.203: U$10.TX 76.2,55.6 74.6,57.2 69,57.2 67.3,55.5
  Top 0.254: 67.3,55.5 67.3,53.1 64.7,50.5 59.6,50.5 58.1,49 57.1,49 v56.9,49.2 | U$3.P$20 52.5,48.7 52.9,49.1 54.1,49.1 v54.6,49.6
  Bottom 0.254: v54.6,49.6 56.5,49.6 v56.9,49.2
VBUS
  Top 0.203: U25.1 D1.A
VCC_1.8  (via drill 0.38)
  Top 0.203: SV1.16 92,27.78 v92,35.9
  Top 0.254: 50.3,47.7 v50.2,47.6 49.05,47.6 C4.1 | v88.4,39.5 v92,35.9 | v67,43.5 66.3,43.5 66,43.2 59.3,43.2 58.35,42.25 U$3.P$10 | U$3.P$2 53.15,42.45 54,43.3 54,44.1 v53.9,44.2
  Bottom 0.203: v92,35.9 94.13,38.03 SV1.26
  Bottom 0.254: v50.2,47.6 50.2,47 51.6,45.6 54.1,45.6 55.1,44.6 | 55.1,44.6 55.3,44.4 67.5,44.4 | 67.5,44.4 88.4,44.4 89,43.8 89,41.4 88.4,40.8 v88.4,39.5 | v67,43.5 67.5,44 67.5,44.4 | v53.9,44.2 54.7,44.2 55.1,44.6
VCC_3.3  (via drill 0.38)
  Top 0.203: U$1.29 12,6.3 11.9,6.2 11.4,6.2 11.3,6.1 C15.1 11.25,5.7 v10.4,5.7 | U$1.23 C17.1 9.05,10.45 8.85,10.65 7.95,10.65 v7.65,10.95 R9.1 7.15,12.1 6.6,12.65 R15.1 | U$1.10 15.8,12.7 16.8,13.7 16.8,13.75 | 16.8,13.75 C22.1 | U$1.5 17.2,9.9 17.4,10.1 C12.1 18.1,10.15 v18.1,11.05 | R15.1 R14.1 | R15.1 R16.1 | C19.1 12.8,14.45 | R8.1 11.9,14.95 12.15,14.7 12.45,14.7 12.9,14.25 C19.1 | v16.6,19.75 16.6,20.7 U18.5 17.88,19.43 C24.+ 18.62,19.43 18.95,19.1 19.65,19.1 20.25,18.5 20.25,15.85 18.1,13.7 v18.05,13.7 16.85,13.7 16.8,13.75 | v12.9,18.15 R7.1 12.15,17.15 11.9,16.9 R8.1 | R8.1 10.95,15.35 IC1.8 10.44,15.79 9,14.35 v9,13.4 | U$1.36 C18.1 v18.05,6.15 | U$1.15 13,14.2 C19.1 | R3.1 4.9,5.85 3.75,5.85 3.25,6.35 3.25,8.15 3.5,8.4 v4.45,8.4
  Bottom 0.203: v12.9,18.15 13.7,18.15 14.15,18.6 14.15,19.2 14.7,19.75 v16.6,19.75 | v9,13.4 7.65,12.05 v7.65,10.95 7.65,8.45 | v18.05,13.7 18.05,11.1 v18.1,11.05 18.05,11 v18.05,6.15 | 7.65,8.45 v10.4,5.7 | 7.65,8.45 7.6,8.4 v4.45,8.4
VCC_5.0  (via drill 0.38)
  Top 0.203: C25.+ 14.07,20.75 U18.1 R18.1 4.9,20.75 0.95,16.8 0.95,7.9 3.4,5.45 7.45,5.45 7.75,5.75 R2.1
  Top 0.254: 62.25,46 59.7,46 59.4,46.3 v59.4,46.8 | 71.5,52.3 65.2,46 62.25,46 | 62.25,46 C3.1 | U$3.P$19 53.15,47.35 52.7,46.9 52,46.9 v51.6,47.3 | C1.1 6.75,6.4 R2.1
  Top 0.406: USB1.VBUS 34.14,9.54 | C16.+ 29.68,8.38 30.6,9.3 34.38,9.3 USB1.VBUS | D1.C 71.5,14.6 68.7,11.8 64.55,11.8 62.55,9.8 USB2.VBUS 62.39,8.91 C20.+ 54.35,10.65 45.7,10.65 42.6,7.55 35.7,7.55 34.61,8.64 USB1.VBUS
  Top 1.27: 13.27,27.23 U$2.6 13.27,32.38 C21.+ 21.21,38.11 23.2,40.1 24.5,40.1 26.6,42.2 26.6,48.8 v28,50.2 | SV1.40 91.73,56.13 87.9,52.3 71.5,52.3 71.12,52.68 U$10.VCC
  Bottom 0.254: v51.6,47.3 51.6,50.1 52.4,50.9 56.8,50.9 59.4,48.3 v59.4,46.8
  Bottom 0.813: USB3.VBUS 19.57,23.4 27.05,23.4 34.61,15.84 USB1.VBUS
  Bottom 1.27: U$10.VCC 68.43,57.3 37.1,57.3 35.56,55.76 U$8.VCC 31.15,50.2 v28,50.2
  pour Top (no thermals): 13.3,21.35 13.3,24.75 12.15,25.9 10.4,25.9 9.35,26.95 9.35,37.7 12.9,41.25 22.5,41.25 25,43.75 27.75,43.75 27.8,43.7 29.5,43.7 30.3,42.9 30.3,27.45 26.25,23.4 21.1,23.4 20.05,22.35 19.1,22.35 17.9,23.55 15.35,23.55 15.05,23.25 15.05,21.6 14.75,21.3 14.6,21.15 14.6,20.55 14.6,20.45 14.45,20.3 11.75,20.3 11.55,20.5 11.55,21.2 11.7,21.35 12.1,21.35
  pour Top (no thermals): 85.4,15.7 70.2,15.7 68.1,13.6 28.35,13.6 26.7,11.95 26.7,7.9 28.4,6.2 30.15,6.2 32.8,3.55 33.35,3 77,3 78.55,4.55 78.55,10.65 80.8,12.9 83.3,12.9 84.7,12.9 85.55,13.75 85.55,14.75 85.55,15.55
VCC_BATT
  Top 0.813: U$2.3 6.92,47.48 6.1,48.3 6.1,48.7 | 6.1,48.7 6.1,50.49 C27.+ | U$7.2 17.62,47 11.3,47 11.11,47.19 C2.+ 9.31,48.7 6.1,48.7
  Top 1.27: U$7.2 21.24,46.86 U$4.CAT
VCC_BATT_RAW
  Top 1.016: 48.26,61.36 U$12.P$1
  Top 1.27: U$9.P$1 83.82,59.98 82.3,61.5 48.4,61.5 | 19.4,61.5 12.3,61.5 11.4,60.6 11.4,54.64 U$11.P$1 | 19.4,61.5 48.4,61.5 | U$7.1 19.5,61.4 19.4,61.5 | 48.4,61.5 48.26,61.36